# EAGLE design CPU (EAGLE 8.2.2)
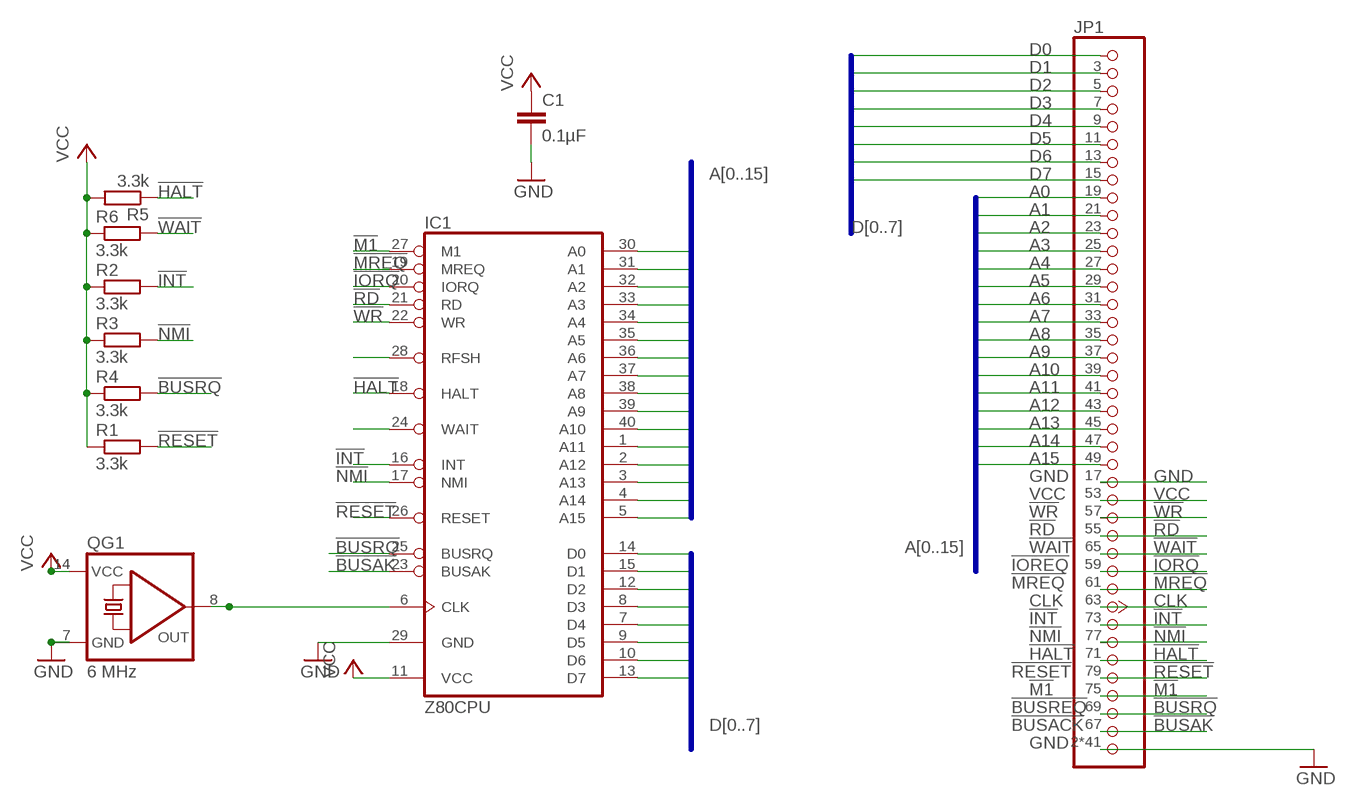
[diagram p0: schematic, sheet 1]

## Parts
C1  0.1µF  C5/2.5  [C5B2.5]
IC1  Z80CPU  [DIL40]
JP1  JEANNECTOR/90  [2X25/90]
QG1  6 MHz  QG5860  [DIL14S]
R1  3.3k  R-EU_0207/2V  [0207/2V]
R2  3.3k  R-EU_0207/2V  [0207/2V]
R3  3.3k  R-EU_0207/2V  [0207/2V]
R4  3.3k  R-EU_0207/2V  [0207/2V]
R5  3.3k  R-EU_0207/2V  [0207/2V]
R6  3.3k  R-EU_0207/2V  [0207/2V]

## Nets
!BUSAK: IC1.23(BUSAK) JP1.67(!BUSACK)
!BUSRQ: IC1.25(BUSRQ) JP1.69(!BUSRQ) R4.2
!HALT: IC1.18(HALT) JP1.71(!HALT) R5.1
!INT: IC1.16(INT) JP1.73(!INT) R2.2
!IORQ: IC1.20(IORQ) JP1.59(!IOREQ)
!M1: IC1.27(M1) JP1.75(!M1)
!MREQ: IC1.19(MREQ) JP1.61(!MREQ)
!NMI: IC1.17(NMI) JP1.77(!NMI) R3.2
!RD: IC1.21(RD) JP1.55(!RD)
!RESET: IC1.26(RESET) JP1.79(!RESET) R1.2
!RFSH: IC1.28(RFSH)
!WAIT: IC1.24(WAIT) JP1.65(!WAIT) R6.2
!WR: IC1.22(WR) JP1.57(!WR)
A0: IC1.30(A0) JP1.19(A0)
A1: IC1.31(A1) JP1.21(A1)
A2: IC1.32(A2) JP1.23(A2)
A3: IC1.33(A3) JP1.25(A3)
A4: IC1.34(A4) JP1.27(A4)
A5: IC1.35(A5) JP1.29(A5)
A6: IC1.36(A6) JP1.31(A6)
A7: IC1.37(A7) JP1.33(A7)
A8: IC1.38(A8) JP1.35(A8)
A9: IC1.39(A9) JP1.37(A9)
A10: IC1.40(A10) JP1.39(A10)
A11: IC1.1(A11) JP1.41(A11)
A12: IC1.2(A12) JP1.43(A12)
A13: IC1.3(A13) JP1.45(A13)
A14: IC1.4(A14) JP1.47(A14)
A15: IC1.5(A15) JP1.49(A15)
CLK: IC1.6(CLK) JP1.63(CLK) QG1.8(OUT)
D0: IC1.14(D0) JP1.1(D0)
D1: IC1.15(D1) JP1.3(D1)
D2: IC1.12(D2) JP1.5(D2)
D3: IC1.8(D3) JP1.7(D3)
D4: IC1.7(D4) JP1.9(D4)
D5: IC1.9(D5) JP1.11(D5)
D6: IC1.10(D6) JP1.13(D6)
D7: IC1.13(D7) JP1.15(D7)
GND: C1.2 IC1.29(GND) JP1.2(GND) JP1.4(GND) JP1.6(GND) JP1.8(GND) JP1.10(GND) JP1.12(GND) JP1.14(GND) JP1.16(GND) JP1.17(GND) JP1.18(GND) JP1.20(GND) JP1.22(GND) JP1.24(GND) JP1.26(GND) JP1.28(GND) JP1.30(GND) JP1.32(GND) JP1.34(GND) JP1.36(GND) JP1.38(GND) JP1.40(GND) JP1.42(GND) JP1.44(GND) JP1.46(GND) JP1.48(GND) JP1.50(GND) JP1.51(GND) JP1.52(GND) JP1.54(GND) JP1.56(GND) JP1.58(GND) JP1.60(GND) JP1.62(GND) JP1.64(GND) JP1.66(GND) JP1.68(GND) JP1.70(GND) JP1.72(GND) JP1.74(GND) JP1.76(GND) JP1.78(GND) JP1.80(GND) QG1.7(GND)
VCC: C1.1 IC1.11(VCC) JP1.53(VCC) QG1.14(VCC) R1.1 R2.1 R3.1 R4.1 R5.2 R6.1

## Buses
A[0..15]
D[0..7]

## Library data of the parts
C1 = capacitor-wima:C: CAPACITOR naming: grid - package width
IC1 = zilog:Z80CPU: Z80 FAMILY DEVICE; OC_FARNELL: unknown
JP1 = jean:JEANNECTOR: PIN HEADER
QG1 = crystal:QG5860: CRYSTAL RESONATOR; OC_FARNELL: unknown; OC_NEWARK: unknown
R1-R6 = resistor:R-EU_: RESISTOR, European symbol

## Board
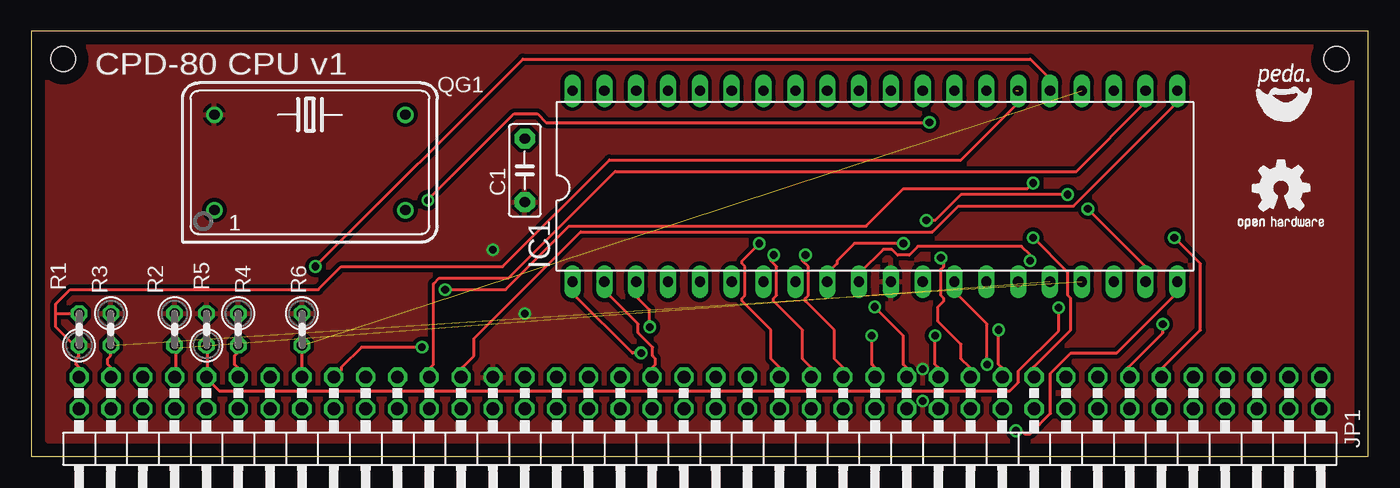
[diagram p1: board, top side]
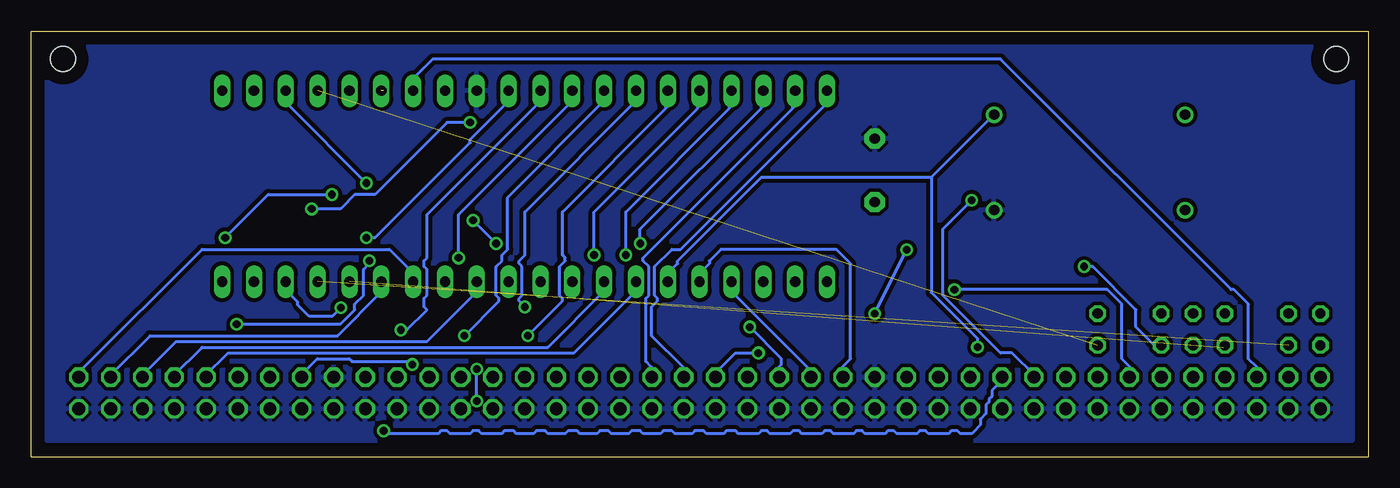
[diagram p2: board, bottom side, seen from below]

Size 106.66 x 33.96 mm. Coordinates in mm from the lower left corner, seen from the top.
Outline: 106.66,0 106.66,33.96 0,33.96 0,0 106.66,0
Copper layers (1*16): Top 0.035mm / dielectric 1.5mm / Bottom 0.035mm
Design rules "default": minimum track width 10mil, minimum drill 24mil, track to track 8mil, track to pad 8mil, pad to pad 8mil, via to via 8mil, smd to smd 8mil, copper to edge 40mil, drill to drill 8mil, minimum pad ring 10mil, minimum via ring 8mil, stop-mask expansion 4mil, vias tented up to drill 0mil, thermal gap 10mil
Holes 2 mm at 2.54,31.75 104.14,31.75

### Footprints (pad centres in the part's own frame; a part is rotated, then mirrored left to right if it is on the bottom)
C5B2.5 = drill 0.813 pad 1.6 octagon: 1 -2.54,0; 2 2.54,0
DIL40 = drill 0.813 long: 1 -24.13,-7.62; 2 -21.59,-7.62; 3 -19.05,-7.62; 4 -16.51,-7.62; 5 -13.97,-7.62; 6 -11.43,-7.62; 7 -8.89,-7.62; 8 -6.35,-7.62; 9 -3.81,-7.62; 10 -1.27,-7.62; 11 1.27,-7.62; 12 3.81,-7.62; 13 6.35,-7.62; 14 8.89,-7.62; 15 11.43,-7.62; 16 13.97,-7.62; 17 16.51,-7.62; 18 19.05,-7.62; 19 21.59,-7.62; 20 24.13,-7.62; 21 24.13,7.62; 22 21.59,7.62; 23 19.05,7.62; 24 16.51,7.62; 25 13.97,7.62; 26 11.43,7.62; 27 8.89,7.62; 28 6.35,7.62; 29 3.81,7.62; 30 1.27,7.62; 31 -1.27,7.62; 32 -3.81,7.62; 33 -6.35,7.62; 34 -8.89,7.62; 35 -11.43,7.62; 36 -13.97,7.62; 37 -16.51,7.62; 38 -19.05,7.62; 39 -21.59,7.62; 40 -24.13,7.62
2X25/90 = drill 1.016 octagon: 1 -29.21,-6.35; 2 -29.21,-3.81; 3 -26.67,-6.35; 4 -26.67,-3.81; 5 -24.13,-6.35; 6 -24.13,-3.81; 7 -21.59,-6.35; 8 -21.59,-3.81; 9 -19.05,-6.35; 10 -19.05,-3.81; 11 -16.51,-6.35; 12 -16.51,-3.81; 13 -13.97,-6.35; 14 -13.97,-3.81; 15 -11.43,-6.35; 16 -11.43,-3.81; 17 -8.89,-6.35; 18 -8.89,-3.81; 19 -6.35,-6.35; 20 -6.35,-3.81; 21 -3.81,-6.35; 22 -3.81,-3.81; 23 -1.27,-6.35; 24 -1.27,-3.81; 25 1.27,-6.35; 26 1.27,-3.81; 27 3.81,-6.35; 28 3.81,-3.81; 29 6.35,-6.35; 30 6.35,-3.81; 31 8.89,-6.35; 32 8.89,-3.81; 33 11.43,-6.35; 34 11.43,-3.81; 35 13.97,-6.35; 36 13.97,-3.81; 37 16.51,-6.35; 38 16.51,-3.81; 39 19.05,-6.35; 40 19.05,-3.81; 41 21.59,-6.35; 42 21.59,-3.81; 43 24.13,-6.35; 44 24.13,-3.81; 45 26.67,-6.35; 46 26.67,-3.81; 47 29.21,-6.35; 48 29.21,-3.81; 49 31.75,-6.35; 50 31.75,-3.81; 51 34.29,-6.35; 52 34.29,-3.81; 53 36.83,-6.35; 54 36.83,-3.81; 55 39.37,-6.35; 56 39.37,-3.81; 57 41.91,-6.35; 58 41.91,-3.81; 59 44.45,-6.35; 60 44.45,-3.81; 61 46.99,-6.35; 62 46.99,-3.81; 63 49.53,-6.35; 64 49.53,-3.81; 65 52.07,-6.35; 66 52.07,-3.81; 67 54.61,-6.35; 68 54.61,-3.81; 69 57.15,-6.35; 70 57.15,-3.81; 71 59.69,-6.35; 72 59.69,-3.81; 73 62.23,-6.35; 74 62.23,-3.81; 75 64.77,-6.35; 76 64.77,-3.81; 77 67.31,-6.35; 78 67.31,-3.81; 79 69.85,-6.35; 80 69.85,-3.81
DIL14S = drill 0.813: 1 -7.62,-3.81; 7 7.62,-3.81; 8 7.62,3.81; 14 -7.62,3.81
0207/2V = drill 0.813 octagon: 1 -1.27,0; 2 1.27,0

### Placement (x,y rotation side)
C1  39.37,22.86 90 top
IC1  67.31,21.59 0 top
JP1  73.66,0 180 top
QG1  22.22,23.5 0 top
R1  3.81,10.16 90 top
R2  11.43,10.16 270 top
R3  6.35,10.16 270 top
R4  16.51,10.16 270 top
R5  13.97,10.16 90 top
R6  21.59,10.16 270 top
U$1  [OSHW2]  95.88,17.14 0 top

### Tracks (layer width: path | path; a pad name or v marks a point on that pad's centre or on a via)
!BUSAK  (via drill 0.61)
  Top 0.254: v79.93,21.85 79.47,21.39 69.58,21.39 66.59,18.4 42.9,18.4 37.84,13.34 v33.01,13.34
  Bottom 0.254: v79.93,21.85 86.14,28.06 86.14,29.21 86.08,29.26 86.31,29.26 IC1.23 | v33.01,13.34 20.82,13.34 19.67,12.19 19.67,7.82 18.98,7.13 18.98,6.44 JP1.67
!BUSRQ  (via drill 0.61)
  Top 0.254: 16.45,8.69 16.45,8.28 16.22,8.05 16.22,7.36 16.45,7.13 16.45,6.44 JP1.69 | 16.45,8.69 16.45,8.74 | v22.66,15.18 39.22,31.74 79.7,31.74 81.08,30.36 81.08,29.21 IC1.25 | R4.2 16.36,8.69 16.45,8.69
  Bottom 0.254: v22.66,15.18 21.97,15.18 18.52,11.73 18.52,10.35 17.14,8.97 16.68,8.97 16.59,8.91 R4.2
!HALT  (via drill 0.61)
  Top 0.254: R5.1 14.07,8.69 14.07,6.4 JP1.71 14.07,6.17 14.99,5.26 78.08,5.26 78.77,5.94 78.77,6.86 81.97,10.06 v81.97,11.89
  Bottom 0.254: v81.97,11.89 82.65,11.2 84.48,11.2 85.39,12.12 85.39,12.34 86.31,13.26 86.31,13.95 IC1.18
!INT  (1 unrouted)
  Top 0.254: R2.2 11.56,8.69 11.56,6.4 JP1.73
!IORQ  (via drill 0.61)
  Top 0.254: 91.43,13.72 91.43,13.11 86.6,8.28 82.92,8.28 81.31,6.67 81.31,3.45 79.7,1.84 79.24,1.84 79.01,2.07 v78.55,2.07 | 91.43,13.72 91.43,13.8 | IC1.20 91.34,13.95 91.34,13.72 91.43,13.72
  Bottom 0.254: v78.55,2.07 78.32,1.84 74.18,1.84 73.95,2.07 73.49,2.07 73.26,1.84 71.65,1.84 71.42,2.07 70.96,2.07 70.73,1.84 69.12,1.84 68.89,2.07 68.2,2.07 67.97,1.84 66.59,1.84 66.36,2.07 65.67,2.07 65.44,1.84 64.06,1.84 63.83,2.07 63.14,2.07 62.91,1.84 61.53,1.84 61.3,2.07 60.61,2.07 60.38,1.84 59,1.84 58.77,2.07 58.08,2.07 57.85,1.84 56.47,1.84 56.24,2.07 55.55,2.07 55.32,1.84 53.94,1.84 53.71,2.07 53.02,2.07 52.79,1.84 51.41,1.84 51.18,2.07 50.49,2.07 50.26,1.84 48.65,1.84 48.42,2.07 47.96,2.07 47.73,1.84 46.12,1.84 45.89,2.07 45.43,2.07 45.2,1.84 43.59,1.84 43.36,2.07 42.9,2.07 42.67,1.84 41.06,1.84 40.83,2.07 40.37,2.07 40.14,1.84 38.53,1.84 38.3,2.07 37.84,2.07 37.61,1.84 36,1.84 35.77,2.07 35.31,2.07 35.08,1.84 33.47,1.84 33.24,2.07 32.78,2.07 32.55,1.84 31.63,1.84 30.94,2.53 30.94,2.99 30.48,3.45 30.48,4.14 30.25,4.37 30.25,4.6 30.02,4.83 30.02,5.29 29.1,6.21 JP1.59
!M1
  Bottom 0.254: 76.02,29.26 76.02,30.36 74.64,31.74 29.33,31.74 10.93,13.34 10.7,13.34 9.55,12.19 9.55,7.82 8.86,7.13 8.86,6.44 JP1.75 | 76.02,29.26 76.02,29.21 | IC1.27 76.02,29.26
!MREQ  (via drill 0.61)
  Top 0.254: v84.3,19.78 88.9,15.18 88.82,15.09 88.82,14.17 IC1.19 | v71.65,26.68 41.06,26.68 40.37,27.37 38.53,27.37 v31.63,20.47
  Bottom 0.254: v84.3,19.78 82,19.78 80.85,20.93 79.24,20.93 73.49,26.68 v71.65,26.68 | v31.63,20.47 33.93,18.17 33.93,12.88 29.33,8.28 28.41,8.28 26.57,6.44 JP1.61
!NMI  (1 unrouted)
  Top 0.254: 6.33,8.69 6.33,8.05 6.1,7.82 6.1,7.36 6.33,7.13 6.33,6.44 JP1.77 | 6.33,8.69 6.33,8.74 | R3.2 6.3,8.69 6.33,8.69
!RD
  Top 0.254: JP1.55 34.39,6.44 34.39,7.13 35.31,8.05 35.31,9.43 43.82,17.94 71.88,17.94 73.95,20.01 83.15,20.01 91.43,28.29 IC1.21 91.34,29.26 IC1.21
!RESET  (1 unrouted)
  Top 0.254: 3.8,8.51 3.8,8.05 3.57,7.82 3.57,7.36 3.8,7.13 3.8,6.44 JP1.79 | 3.8,8.51 3.8,8.74 | 78.55,29.21 78.55,28.06 74.18,23.69 46.12,23.69 37.61,15.18 24.73,15.18 22.89,13.34 3.11,13.34 1.96,12.19 1.96,11.43 | 1.96,11.43 1.96,10.35 3.8,8.51 | 1.96,11.43 R1.2 | 1.96,11.43
!WAIT  (1 unrouted)
  Top 0.254: R6.2 21.61,8.69 21.61,6.4 JP1.65
!WR
  Top 0.254: IC1.22 88.9,28.29 83.38,22.77 46.58,22.77 38.07,14.26 32.55,14.26 32.09,13.8 32.09,7.36 31.86,7.13 31.86,6.44 31.9,6.4 JP1.57
A0  (via drill 0.61)
  Top 0.254: v79.93,17.48 82.69,14.72 82.69,12.88 82.92,12.65 82.92,10.12 79.93,7.13 79.93,6.44 JP1.19
  Bottom 0.254: v79.93,17.48 79.24,17.48 71.65,25.07 71.65,25.3 68.66,28.29 68.66,29.21 IC1.30
A1  (via drill 0.61)
  Top 0.254: v77.17,10.12 77.17,7.36 77.4,7.13 77.4,6.44 JP1.21
  Bottom 0.254: v77.17,10.12 76.71,10.12 75.1,11.73 75.33,11.96 75.33,12.65 75.1,12.88 75.1,14.95 75.33,15.18 75.33,15.64 75.1,15.87 75.1,19.32 66.13,28.29 66.13,29.21 IC1.31
A2  (via drill 0.61)
  Top 0.254: v72.57,15.87 72.8,15.64 72.8,15.18 72.57,14.95 72.57,12.88 72.8,12.65 72.8,12.42 72.34,11.96 72.34,10.81 74.18,8.97 74.18,7.82 74.87,7.13 74.87,6.44 JP1.23
  Bottom 0.254: v72.57,15.87 72.57,19.32 63.6,28.29 63.6,29.21 IC1.32
A3  (via drill 0.61)
  Top 0.254: v72.11,9.66 72.11,7.36 72.34,7.13 72.34,6.44 JP1.25
  Bottom 0.254: v72.11,9.66 69.35,12.42 69.35,12.65 69.58,12.88 69.58,15.18 69.12,15.64 69.12,16.1 68.66,16.56 68.66,20.7 61.07,28.29 61.07,29.21 IC1.33
A4  (via drill 0.61)
  Top 0.254: v67.28,11.96 69.58,9.66 69.58,7.36 69.81,7.13 69.81,6.44 JP1.27
  Bottom 0.254: v67.28,11.96 67.74,12.42 67.74,12.65 67.51,12.88 67.51,15.18 67.74,15.41 67.74,15.64 67.28,16.1 67.28,19.55 58.54,28.29 58.54,29.21 IC1.34
A5  (via drill 0.61)
  Top 0.254: v67.05,9.66 67.05,7.36 67.28,7.13 67.28,6.44 JP1.29
  Bottom 0.254: v67.05,9.66 64.29,12.42 64.29,12.65 64.52,12.88 64.52,15.18 64.06,15.64 64.06,15.87 64.29,16.1 64.29,19.55 56.01,27.83 56.01,29.21 IC1.35
A6  (via drill 0.61)
  Top 0.254: v61.76,16.1 61.53,15.87 61.53,15.64 61.99,15.18 61.99,12.88 61.76,12.65 61.76,12.42 64.06,10.12 64.06,7.82 64.75,7.13 64.75,6.44 JP1.31
  Bottom 0.254: v61.76,16.1 61.76,19.55 53.48,27.83 53.48,29.21 IC1.36
A7  (via drill 0.61)
  Top 0.254: v59.23,16.1 59,15.87 59,15.64 59.46,15.18 59.46,12.88 59.23,12.65 59.23,12.42 61.53,10.12 61.53,7.82 62.22,7.13 62.22,6.44 JP1.33
  Bottom 0.254: v59.23,16.1 59.23,19.55 50.95,27.83 50.95,29.21 IC1.37
A8  (via drill 0.61)
  Top 0.254: v58.08,17.02 56.7,15.64 56.7,15.41 56.93,15.18 56.93,12.88 56.7,12.65 56.7,12.42 59,10.12 59,7.82 59.69,7.13 JP1.35
  Bottom 0.254: v58.08,17.02 58.08,18.17 48.42,27.83 48.42,29.21 IC1.38
A9
  Bottom 0.254: IC1.39 45.89,29.21 45.89,27.83 57.85,15.87 57.85,15.64 57.39,15.18 57.39,12.88 57.62,12.65 57.62,7.59 57.16,7.13 57.16,6.44 JP1.37
A10
  Bottom 0.254: IC1.40 43.36,29.21 43.36,28.06 54.86,16.56 55.55,16.56 56.93,15.18 56.93,12.88 56.7,12.65 56.7,12.42 57.16,11.96 57.16,9.66 54.63,7.13 54.63,6.44 JP1.39
A11  (via drill 0.61)
  Top 0.254: v48.65,8.28 47.96,8.28 43.36,12.88 43.36,13.8 IC1.1
  Bottom 0.254: v48.65,8.28 50.49,8.28 51.87,6.9 51.87,6.44 JP1.41
A12
  Top 0.254: IC1.2 45.89,13.8 45.89,13.11 48.42,10.58 48.42,9.89 49.57,8.74 49.57,8.05 49.8,7.82 49.8,7.36 49.57,7.13 49.57,6.44 JP1.43
A13  (via drill 0.61)
  Top 0.254: v49.34,10.35 49.34,11.73 48.42,12.65 48.42,13.8 IC1.3
  Bottom 0.254: v49.34,10.35 46.81,7.82 46.81,7.36 47.04,7.13 47.04,6.44 JP1.45
A14
  Bottom 0.254: IC1.4 50.72,13.8 50.72,13.11 44.51,6.9 44.51,6.44 JP1.47
A15
  Bottom 0.254: IC1.5 53.25,14.03 53.25,14.72 52.56,15.41 52.56,15.64 51.64,16.56 42.44,16.56 41.29,15.41 41.29,7.82 41.98,7.13 41.98,6.44 JP1.49
CLK  (via drill 0.61)
  Top 0.254: v31.17,8.74 26.34,8.74 24.73,7.13 24.73,6.9 24.27,6.44 JP1.63
  Bottom 0.254: 34.85,22.31 30.02,27.14 30.07,27.2 29.84,27.2 QG1.8 | 34.85,22.31 48.42,22.31 55.09,15.64 55.09,15.41 55.78,14.72 55.78,14.17 | 55.78,14.03 55.78,14.17 | v31.17,8.74 31.17,9.43 34.85,13.11 34.85,22.31 | 55.78,14.17 55.91,14.17 IC1.6
D0
  Bottom 0.254: IC1.14 76.25,14.03 76.25,14.72 78.09,16.56 93.04,16.56 102.7,6.9 102.7,6.44 JP1.1
D1
  Bottom 0.254: IC1.15 78.78,13.8 78.78,13.11 82.23,9.66 97.18,9.66 100.4,6.44 JP1.3
D2
  Bottom 0.254: IC1.12 71.19,13.8 71.19,13.11 75.1,9.2 95.11,9.2 97.87,6.44 JP1.5
D3
  Bottom 0.254: IC1.8 61.07,13.8 61.07,13.11 65.44,8.74 93.04,8.74 95.34,6.44 JP1.7
D4
  Bottom 0.254: IC1.7 58.54,13.8 58.54,13.11 63.37,8.28 90.97,8.28 92.81,6.44 JP1.9
D5  (via drill 0.61)
  Top 0.254: v69.58,17.02 65.67,17.02 64.29,15.64 64.29,15.41 63.6,14.72 63.6,14.03 IC1.9 | v71.42,18.86 72.11,18.86 74.18,20.93 v82.69,20.93 | v91.2,17.48 93.27,15.41 93.27,10.12 90.28,7.13 90.28,6.44 JP1.11
  Bottom 0.254: v71.42,18.86 v69.58,17.02 | v82.69,20.93 87.75,20.93 v91.2,17.48
D6  (via drill 0.61)
  Top 0.254: v79.7,15.64 79.7,16.1 79.01,16.79 70.73,16.79 70.04,16.1 69.12,16.1 68.66,16.56 67.97,16.56 66.13,14.72 66.13,14.03 IC1.10 | v90.28,10.58 90.28,9.89 87.52,7.13 87.52,6.44 JP1.13
  Bottom 0.254: v79.7,15.64 79.7,15.41 80.16,14.95 80.16,12.88 80.85,12.19 80.85,11.73 82,10.58 v90.28,10.58
D7  (via drill 0.61)
  Top 0.254: v76.25,7.36 76.25,10.58 73.72,13.11 73.72,13.8 IC1.13
  Bottom 0.254: v76.25,7.36 76.48,7.59 81.08,7.59 81.31,7.82 83.84,7.82 85.22,6.44 JP1.15
GND
  pour Bottom (isolate 0.305): 1.27,33.02 1.27,1.27 105.41,1.27 105.41,33.02
VCC  (via drill 0.6)
  Bottom 0.254: v39.37,11.43 v36.83,16.51 | v71.12,4.45 v71.12,6.99
  pour Top (isolate 0.305): 1.27,33.02 1.27,1.27 105.41,1.27 105.41,33.02

### Text on the board
tPlace: CPD-80 CPU v1